# Altium schematic sheet PLC_V1.0.SchDoc: Mạch PLC
size 420 x 297 mm; SheetNumber: 1; SheetTotal: 9; Tên Bản Vẽ: Mạch PLC; Version: V1.0; Người Tạo: Nguyễn Hồng Sơn; Người Kiểm Tra: None; Ngày Kiểm Tra: None; Số Trang: 1
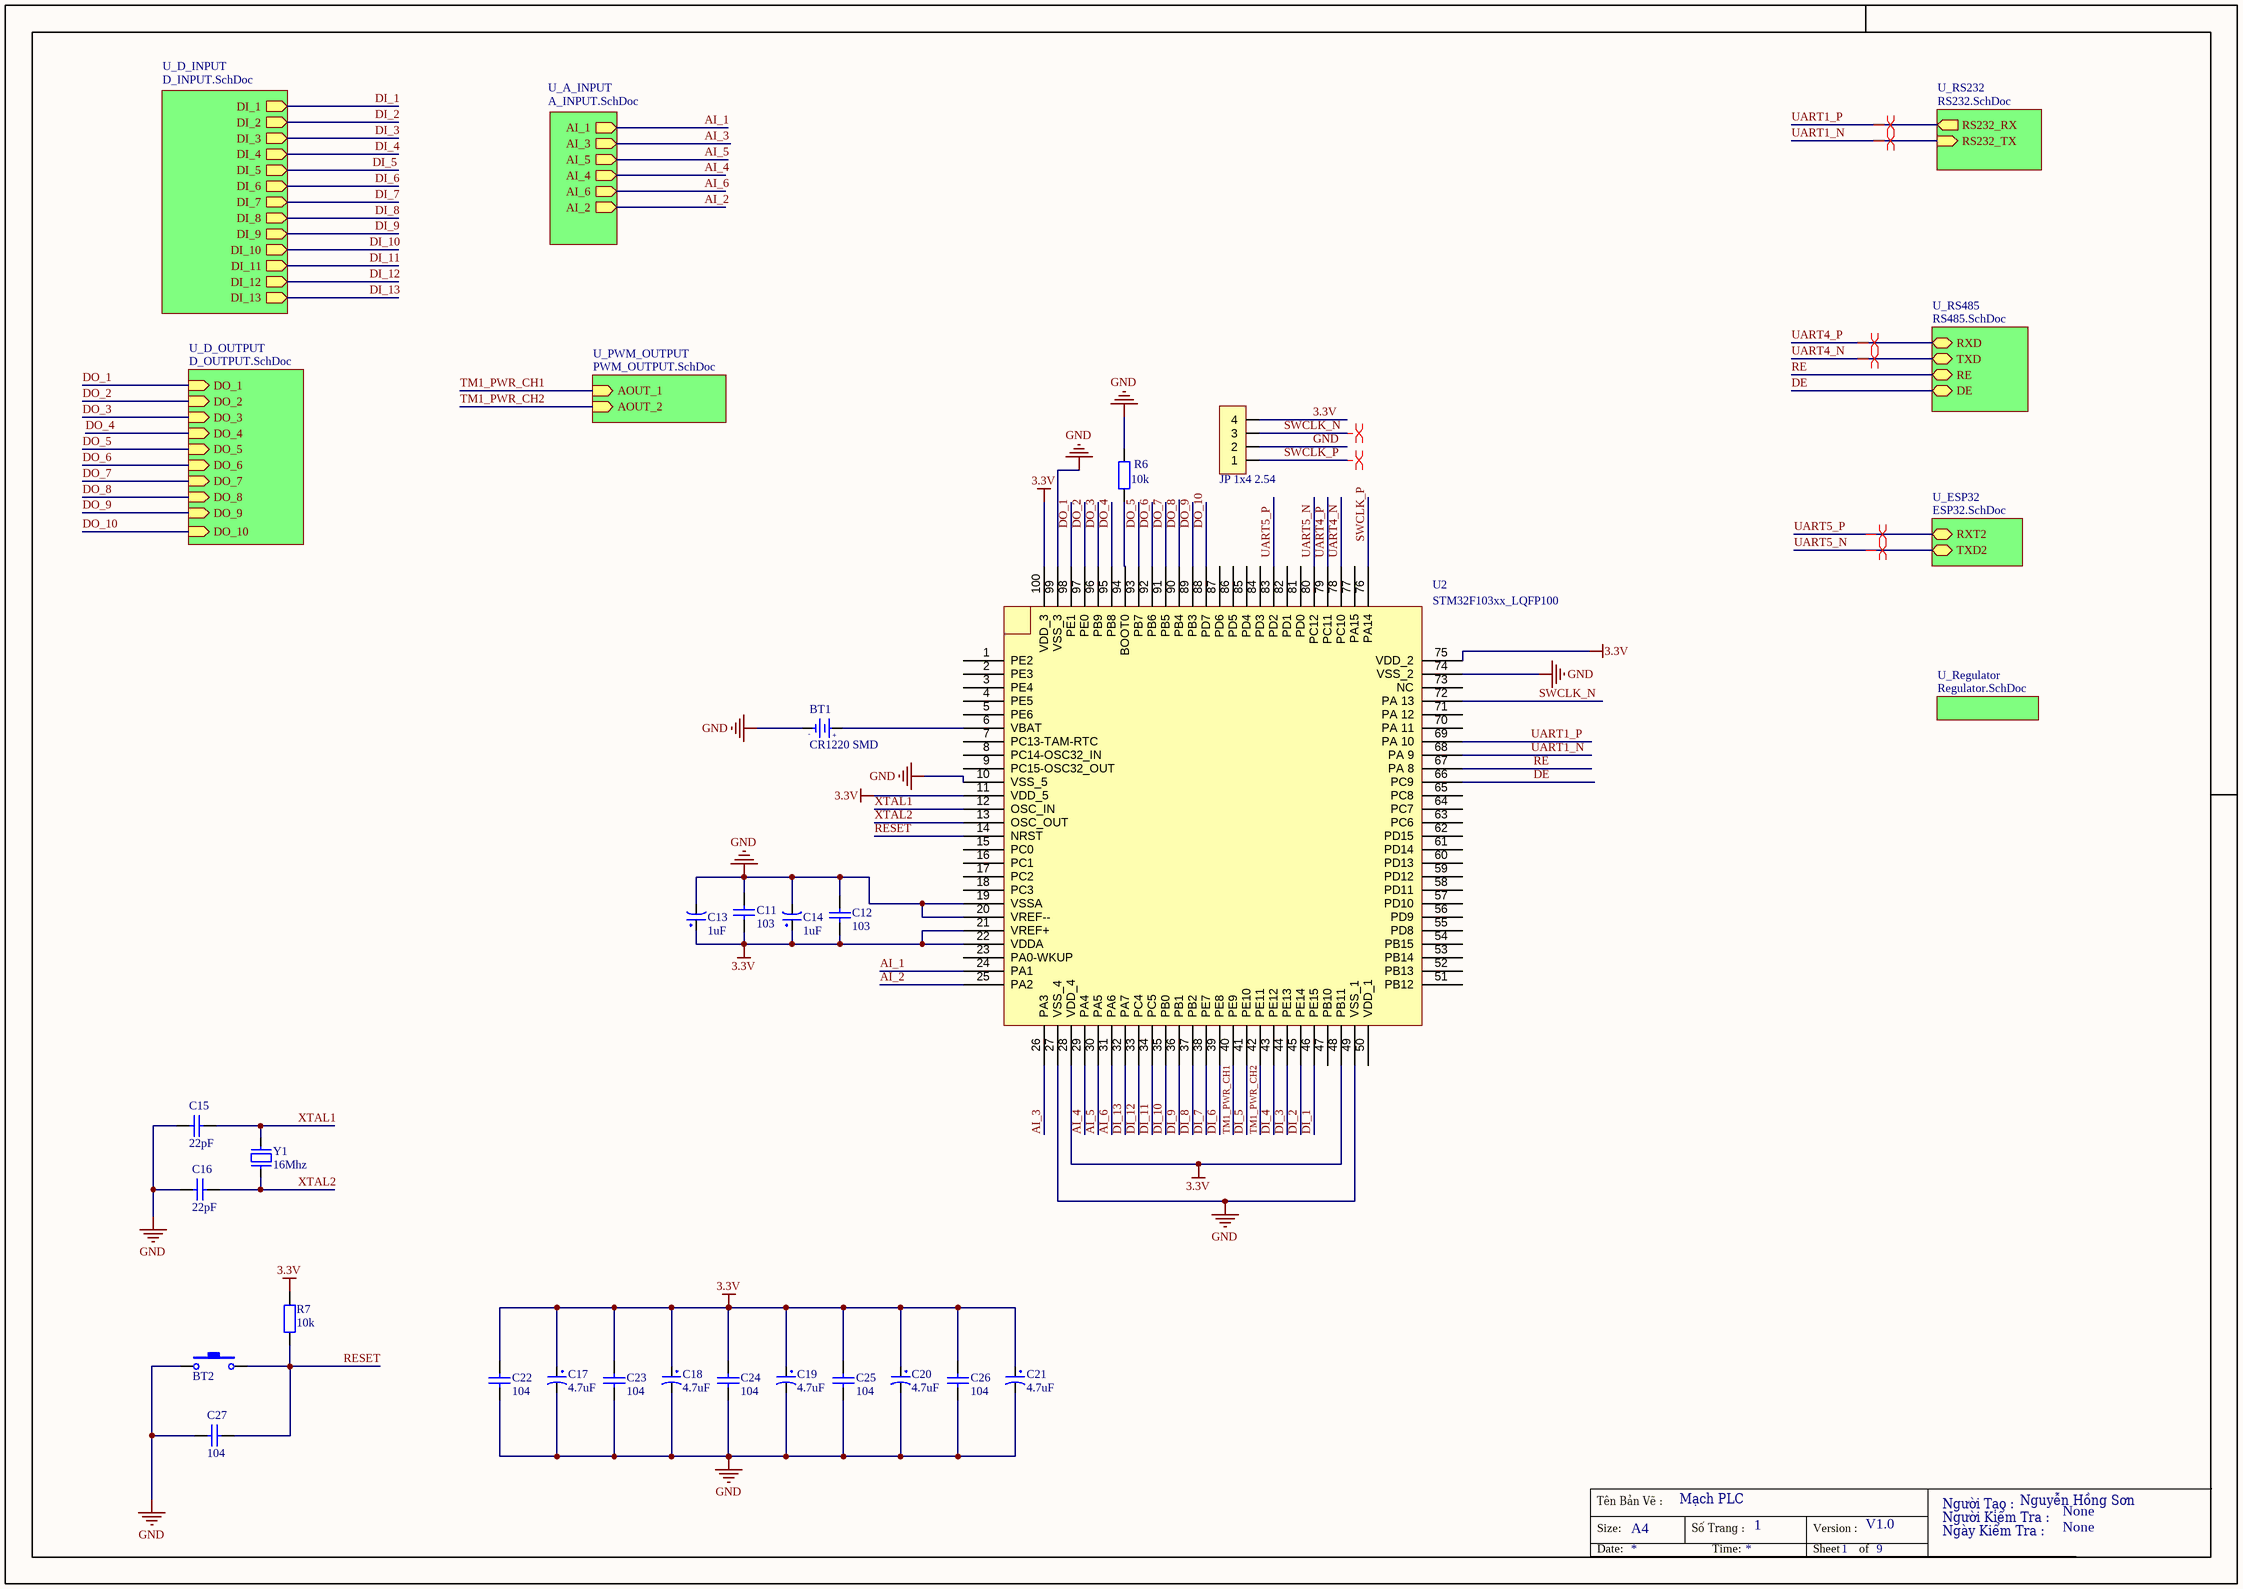
[diagram p0: PLC_V1.0.SchDoc]

## Parts
BT1  CR1220 SMD  [DE PIN CR1220]
BT2  Nut Nhan 2 Chan SMD 3x6x2.5  [Nut Nhan 2 Chan SMD 3x6x2.5]  (value not drawn)
C11  103  [tu 0603]
C12  103  [tu 0603]
C13  1uF  [tu tantalum smd3216]
C14  1uF  [tu tantalum smd3216]
C15  22pF  [tu 0805]
C16  22pF  [tu 0805]
C17  4.7uF  [tu tantalum smd6032]
C18  4.7uF  [tu tantalum smd6032]
C19  4.7uF  [tu tantalum smd6032]
C20  4.7uF  [tu tantalum smd6032]
C21  4.7uF  [tu tantalum smd6032]
C22  104  [tu 0805]
C23  104  [tu 0805]
C24  104  [tu 0805]
C25  104  [tu 0805]
C26  104  [tu 0805]
C27  104  [tu 0805]
JP1  JP 1x4 2.54  [JP 1x4 DT]
R6  10k  [tro smd 0805]
R7  10k  [tro smd 0805]
U2  STM32F103xx_LQFP100  [STM32_LQFP100]
Y1  16Mhz  [Thach Anh 2 chan SMD]

## Sub-sheets
U_A_INPUT = A_INPUT.SchDoc: AI_1 (out), AI_3 (out), AI_5 (out), AI_4 (out), AI_6 (out), AI_2 (out)
U_D_INPUT = D_INPUT.SchDoc: DI_1 (out), DI_2 (out), DI_3 (out), DI_4 (out), DI_5 (out), DI_6 (out), DI_7 (out), DI_8 (out), DI_9 (out), DI_10 (out), DI_11 (out), DI_12 (out), DI_13 (out)
U_D_OUTPUT = D_OUTPUT.SchDoc: DO_1 (in), DO_2 (in), DO_3 (in), DO_4 (in), DO_5 (in), DO_6 (in), DO_7 (in), DO_8 (in), DO_9 (in), DO_10 (in)
U_ESP32 = ESP32.SchDoc: RXT2 (bidir), TXD2 (bidir)
U_PWM_OUTPUT = PWM_OUTPUT.SchDoc: AOUT_1 (in), AOUT_2 (in)
U_Regulator = Regulator.SchDoc: no entries
U_RS232 = RS232.SchDoc: RS232_RX (out), RS232_TX (in)
U_RS485 = RS485.SchDoc: RXD (bidir), TXD (bidir), RE (bidir), DE (bidir)

## Nets
3.3V: C11.1 C12.1 C13.1 C14.1 C17.1 C18.1 C19.1 C20.1 C21.1 C22.2 C23.2 C24.2 C25.2 C26.2 JP1.4 R7.1 U2.11(VDD_5) U2.21(VREF+) U2.22(VDDA) U2.28(VDD_4) U2.48(PB11) U2.75(VDD_2) U2.100(VDD_3)
GND: BT1.2(GND) BT2.1 C11.2 C12.2 C13.2 C14.2 C15.2 C16.2 C17.2 C18.2 C19.2 C20.2 C21.2 C22.1 C23.1 C24.1 C25.1 C26.1 C27.2 JP1.2 R6.2 U2.10(VSS_5) U2.19(VSSA) U2.20(VREF--) U2.27(VSS_4) U2.49(VSS_1) U2.74(VSS_2) U2.99(VSS_3)
AI_1: U2.24(PA1) ; sheet U_A_INPUT/AI_1
AI_2: U2.25(PA2) ; sheet U_A_INPUT/AI_2
AI_3: U2.26(PA3) ; sheet U_A_INPUT/AI_3
AI_4: U2.29(PA4) ; sheet U_A_INPUT/AI_4
AI_5: U2.30(PA5) ; sheet U_A_INPUT/AI_5
AI_6: U2.31(PA6) ; sheet U_A_INPUT/AI_6
DE: U2.66(PC9) ; sheet U_RS485/DE
DI_1: U2.46(PE15) ; sheet U_D_INPUT/DI_1
DI_2: U2.45(PE14) ; sheet U_D_INPUT/DI_2
DI_3: U2.44(PE13) ; sheet U_D_INPUT/DI_3
DI_4: U2.43(PE12) ; sheet U_D_INPUT/DI_4
DI_5: U2.41(PE10) ; sheet U_D_INPUT/DI_5
DI_6: U2.39(PE8) ; sheet U_D_INPUT/DI_6
DI_7: U2.38(PE7) ; sheet U_D_INPUT/DI_7
DI_8: U2.37(PB2) ; sheet U_D_INPUT/DI_8
DI_9: U2.36(PB1) ; sheet U_D_INPUT/DI_9
DI_10: U2.35(PB0) ; sheet U_D_INPUT/DI_10
DI_11: U2.34(PC5) ; sheet U_D_INPUT/DI_11
DI_12: U2.33(PC4) ; sheet U_D_INPUT/DI_12
DI_13: U2.32(PA7) ; sheet U_D_INPUT/DI_13
DO_1: U2.98(PE1) ; sheet U_D_OUTPUT/DO_1
DO_2: U2.97(PE0) ; sheet U_D_OUTPUT/DO_2
DO_3: U2.96(PB9) ; sheet U_D_OUTPUT/DO_3
DO_4: U2.95(PB8) ; sheet U_D_OUTPUT/DO_4
DO_5: U2.93(PB7) ; sheet U_D_OUTPUT/DO_5
DO_6: U2.92(PB6) ; sheet U_D_OUTPUT/DO_6
DO_7: U2.91(PB5) ; sheet U_D_OUTPUT/DO_7
DO_8: U2.90(PB4) ; sheet U_D_OUTPUT/DO_8
DO_9: U2.89(PB3) ; sheet U_D_OUTPUT/DO_9
DO_10: U2.88(PD7) ; sheet U_D_OUTPUT/DO_10
RE: U2.67(PA_8) ; sheet U_RS485/RE
RESET: BT2.2 C27.1 R7.2 U2.14(NRST)
SWCLK_N: JP1.3 U2.72(PA_13)
SWCLK_P: JP1.1 U2.76(PA14)
TM1_PWR_CH1: U2.40(PE9) ; sheet U_PWM_OUTPUT/AOUT_1
TM1_PWR_CH2: U2.42(PE11) ; sheet U_PWM_OUTPUT/AOUT_2
UART1_N: U2.68(PA_9) ; sheet U_RS232/RS232_TX
UART1_P: U2.69(PA_10) ; sheet U_RS232/RS232_RX
UART4_N: U2.78(PC10) ; sheet U_RS485/TXD
UART4_P: U2.79(PC11) ; sheet U_RS485/RXD
UART5_N: U2.80(PC12) ; sheet U_ESP32/TXD2
UART5_P: U2.83(PD2) ; sheet U_ESP32/RXT2
XTAL1: C15.1 U2.12(OSC_IN) Y1.2
XTAL2: C16.1 U2.13(OSC_OUT) Y1.1
NetBT1_1: BT1.1(+3V) U2.6(VBAT)
NetR6_1: R6.1 U2.94(BOOT0)

Not connected (* = marked no-connect by the designer): U2 1(PE2) 2(PE3) 3(PE4) 4(PE5) 5(PE6) 7(PC13-TAM-RTC) 8(PC14-OSC32_IN) 9(PC15-OSC32_OUT) 15(PC0) 16(PC1) 17(PC2) 18(PC3) 23(PA0-WKUP) 47(PB10) 50(VDD_1) 51(PB12) 52(PB13) 53(PB14) 54(PB15) 55(PD8) 56(PD9) 57(PD10) 58(PD11) 59(PD12) 60(PD13) 61(PD14) 62(PD15) 63(PC6) 64(PC7) 65(PC8) 70(PA_11) 71(PA_12) 73(NC) 77(PA15) 81(PD0) 82(PD1) 84(PD3) 85(PD4) 86(PD5) 87(PD6)

## Layout directives
differential pair: SWCLK_N, SWCLK_P, UART1_N, UART1_P, UART4_N, UART4_P, UART5_N, UART5_P

## Notes on the sheet
- Tên Bản Vẽ :
- Size:
- A4
- Số Trang :
- Version :
- Người Tạo :
- Người Kiểm Tra :
- Ngày Kiểm Tra :
- Date:
- Time:
- Sheet
- of
- (in symbol De pin CR1220 SMD) -; +

## Library data of the parts
BT1 = De pin CR1220 SMD: Ten: Đế PIN CR1220 SMD; Ma_Hang: MH000833
BT2 = Nut Nhan 2 Chan SMD 3x6x2.5: Ma_Hang: MH001036; Ten: Nút Nhấn 2 Chân 3x6x2.5MM SMD
C11 C12 = Tu 0603 103 50V 10%: Dán; Don_Vi: Con; So_Chan: 2; Ten_Linh_Kien: Tụ 0603 103-10nF 10% 50V; Ma_Hang: MH004567; Chung_Loai: Dán; Kieu_Chan: *
C13 C14 = Tu tantalum 1uF 25V SMD3216: Dán; Don_Vi: Con; So_Chan: 2; Ten_Linh_Kien: Tụ tantalum 105E-1uF 25V SMD3216; Ma_Hang: MH007472; Chung_Loai: Dán; Kieu_Chan: *
C15 C16 = Tu 0805 22pF 50V 10%: Dán; Don_Vi: Con; So_Chan: 2; Ten_Linh_Kien: Tụ 0805 22P 10% 50V; Ma_Hang: MH004560; Chung_Loai: Dán; Kieu_Chan: *
C17-C21 = Tu tantalum 4.7uF 35V SMD6032: Dán; Don_Vi: Con; So_Chan: 2; Ten_Linh_Kien: Tụ tantalum 475V-4.7uF 35V SMD6032; Ma_Hang: MH008687; Chung_Loai: Dán; Kieu_Chan: *
C22-C26 = Tu 0805 104 50V 10%: Dán 100nF; Don_Vi: Con; So_Chan: 2; Ten_Linh_Kien: Tụ 0805 104-100nF 10% 50V; Ma_Hang: MH004551; Chung_Loai: Dán; Kieu_Chan: *
  C22: Parameter 1: *
C27 = Tu 0805 104 50V 10%: Dán; Don_Vi: Con; So_Chan: 2; Ten_Linh_Kien: Tụ 0805 104-100nF 10% 50V; Ma_Hang: MH004551; Chung_Loai: Dán; Kieu_Chan: *
JP1 = JP 1x4 2.54 Duc Thang: Cắm; Ten_Linh_Kien: Jump Đơn Đực 2.54MM 1x40P Thẳng 11MM; Don_Vi: Con; Ma_Hang: MH000903; Ghi_Chu: *; Kieu_Chan: *; Chung_Loai: Cắm
R6 R7 = Tro 0805 5% 10k: Dán; Don_Vi: Con; So_Chan: 2; Ten_Linh_Kien: Trở 0805 5% 10k; Ma_Hang: MH005239; Chung_Loai: Dán; Kieu_Chan: *
Y1 = Thach Anh 2 chan SMD: Crystal For all Crystal 2pin.; Value: 4Mhz